# Altium schematic sheet 07_ux.SchDoc
size B
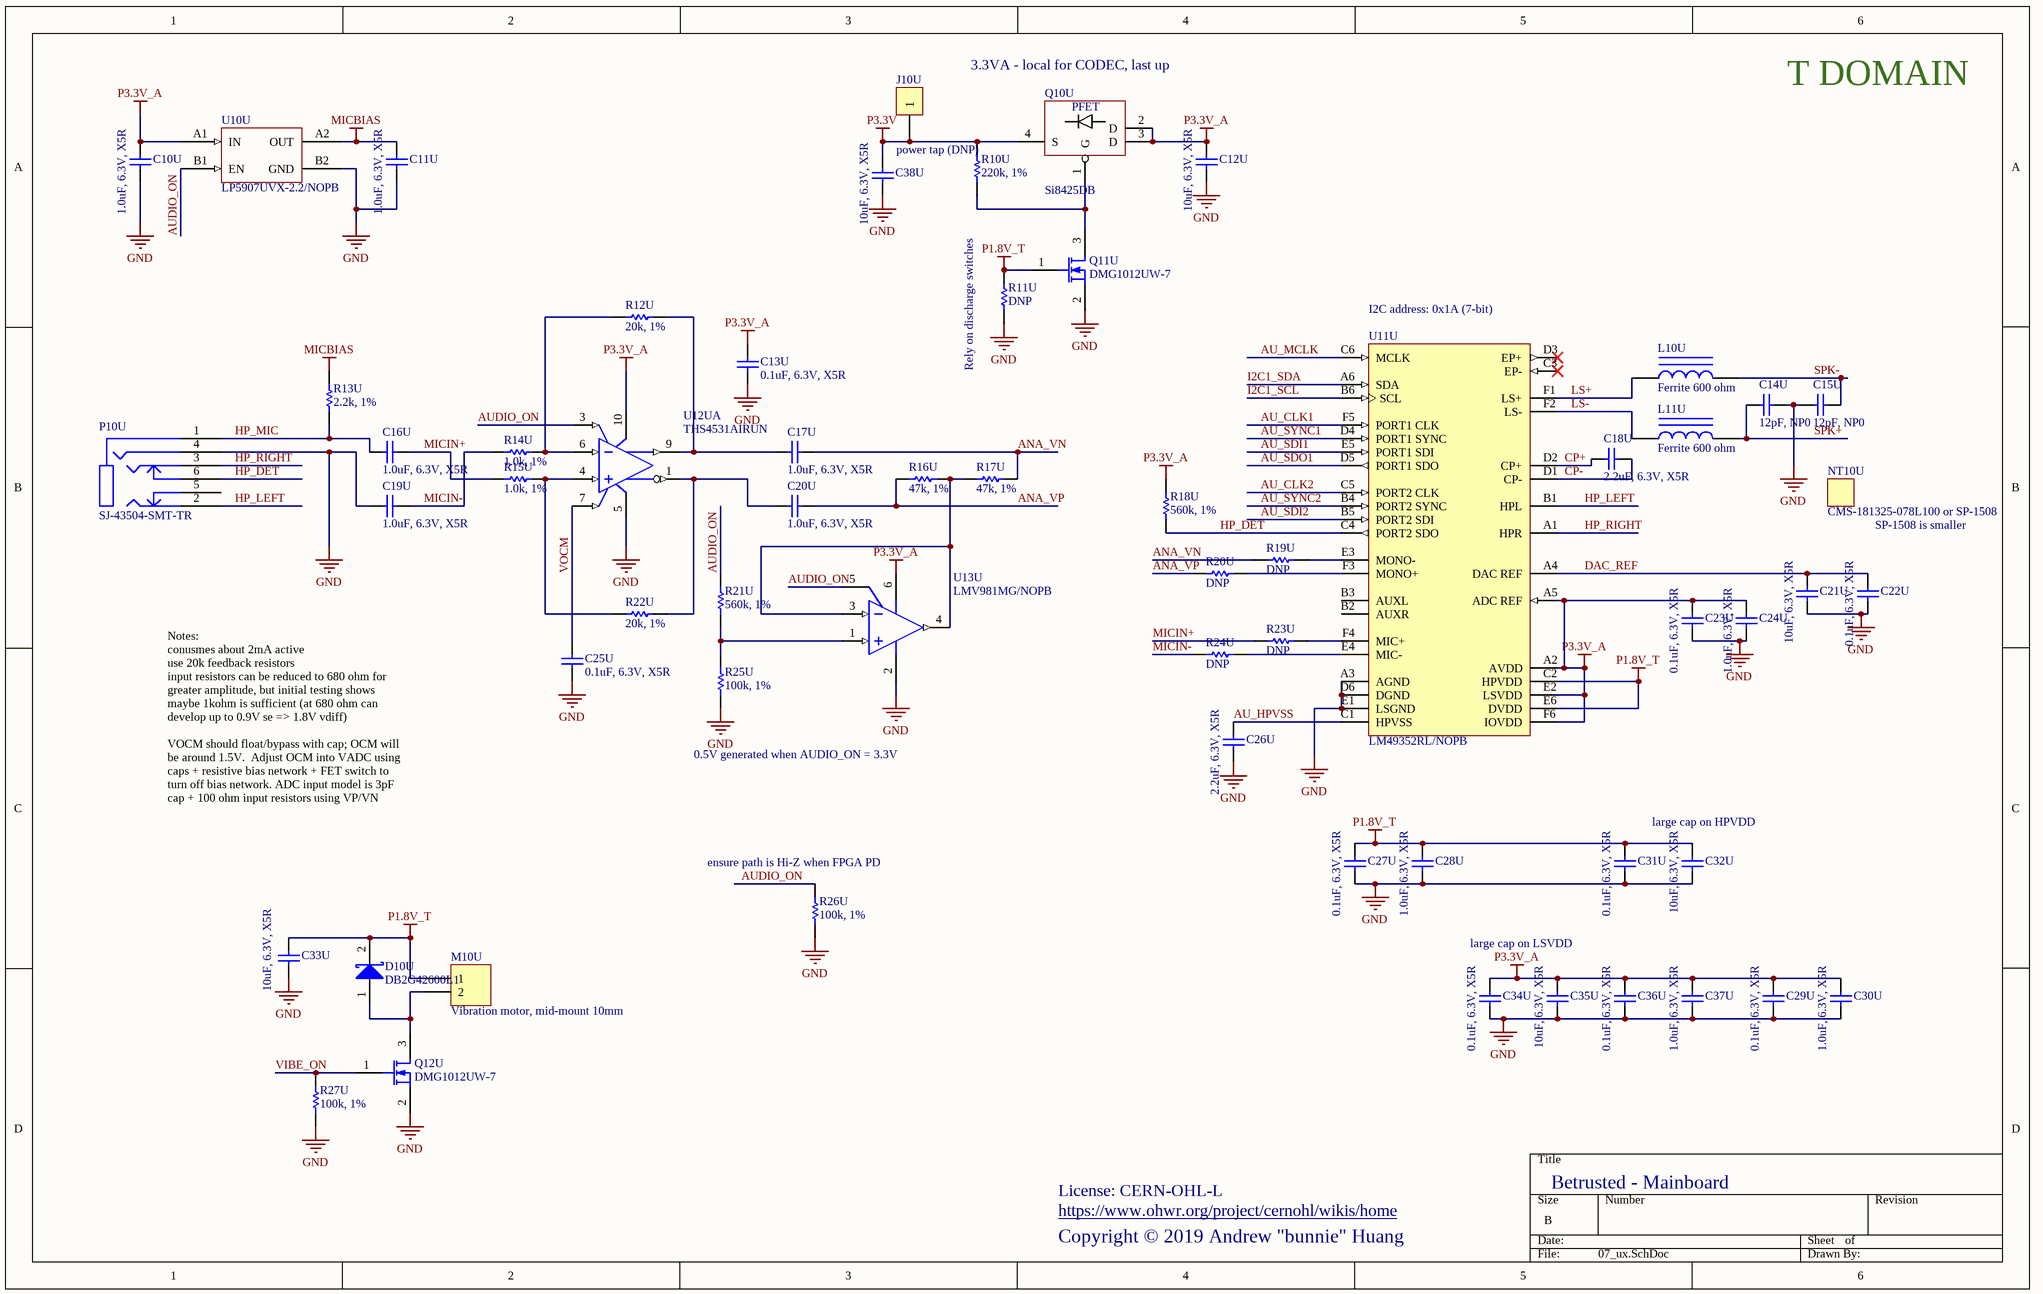
[diagram p0: 07_ux.SchDoc]

## Parts
C10U  1.0uF, 6.3V, X5R  [B_CAP0201]
C11U  1.0uF, 6.3V, X5R  [B_CAP0201]
C12U  10uF, 6.3V, X5R  [B_CAP0603]
C13U  0.1uF, 6.3V, X5R  [B_CAP0201]
C14U  12pF, NP0  [B_CAP0201]
C15U  12pF, NP0  [B_CAP0201]
C16U  1.0uF, 6.3V, X5R  [B_CAP0201]
C17U  1.0uF, 6.3V, X5R  [B_CAP0201]
C18U  2.2uF, 6.3V, X5R  [B_CAP0402]
C19U  1.0uF, 6.3V, X5R  [B_CAP0201]
C20U  1.0uF, 6.3V, X5R  [B_CAP0201]
C21U  10uF, 6.3V, X5R  [B_CAP0603]
C22U  0.1uF, 6.3V, X5R  [B_CAP0201]
C23U  0.1uF, 6.3V, X5R  [B_CAP0201]
C24U  1.0uF, 6.3V, X5R  [B_CAP0201]
C25U  0.1uF, 6.3V, X5R  [B_CAP0201]
C26U  2.2uF, 6.3V, X5R  [B_CAP0402]
C27U  0.1uF, 6.3V, X5R  [B_CAP0201]
C28U  1.0uF, 6.3V, X5R  [B_CAP0201]
C29U  0.1uF, 6.3V, X5R  [B_CAP0201]
C30U  1.0uF, 6.3V, X5R  [B_CAP0201]
C31U  0.1uF, 6.3V, X5R  [B_CAP0201]
C32U  10uF, 6.3V, X5R  [B_CAP0603]
C33U  10uF, 6.3V, X5R  [B_CAP0603]
C34U  0.1uF, 6.3V, X5R  [B_CAP0201]
C35U  10uF, 6.3V, X5R  [B_CAP0603]
C36U  0.1uF, 6.3V, X5R  [B_CAP0201]
C37U  1.0uF, 6.3V, X5R  [B_CAP0201]
C38U  10uF, 6.3V, X5R  [B_CAP0603]
D10U  DB2G42600L1  [B_DIO0402]
J10U  power tap (DNP)  [RESTAP-0603]
L10U  Ferrite 600 ohm  [B_IND0603]
L11U  Ferrite 600 ohm  [B_IND0603]
M10U  Vibration motor, mid-mount 10mm  [JINLONG-C1020K001F]
NT10U  CMS-181325-078L100 or SP-1508
P10U  SJ-43504-SMT-TR  [CUI_SJ_43504_SMT_TR_FLIP]
Q10U  Si8425DB  [VISHAY_MICRO_FOOT_4_BUMP]
Q11U  DMG1012UW-7  [SOT323-3AN]
Q12U  DMG1012UW-7  [SOT323-3AN]
R10U  220k, 1%  [B_RES0201]
R11U  DNP  [B_RES0201]
R12U  20k, 1%  [B_RES0201]
R13U  2.2k, 1%  [B_RES0201]
R14U  1.0k, 1%  [B_RES0201]
R15U  1.0k, 1%  [B_RES0201]
R16U  47k, 1%  [B_RES0201]
R17U  47k, 1%  [B_RES0201]
R18U  560k, 1%  [B_RES0201]
R19U  DNP  [B_RES0201]
R20U  DNP  [B_RES0201]
R21U  560k, 1%  [B_RES0201]
R22U  20k, 1%  [B_RES0201]
R23U  DNP  [B_RES0201]
R24U  DNP  [B_RES0201]
R25U  100k, 1%  [B_RES0201]
R26U  100k, 1%  [B_RES0201]
R27U  100k, 1%  [B_RES0201]
U10U  LP5907UVX-2.2/NOPB  [TI_YKE004]
U11U  LM49352RL/NOPB  [YPG0036AWAW]
U12U  THS4531AIRUN  [RUN0010A]  (part A of 2)
U13U  LMV981MG/NOPB  [DCK0006A_N]

## Nets
GND: C10U.2 C11U.2 C12U.2 C13U.1 C14U.2 C15U.1 C19U.1 C21U.2 C22U.2 C23U.2 C24U.1 C25U.1 C26U.1 C27U.2 C28U.1 C29U.2 C30U.1 C31U.2 C32U.2 C33U.1 C34U.2 C35U.2 C36U.2 C37U.1 C38U.2 P10U.4(RING2) Q11U.2(S) Q12U.2(S) R11U.1 R25U.1 R26U.1 R27U.1 U10U.B2(GND) U11U.A3(AGND) U11U.D6(DGND) U11U.E1(LSGND) U12U.5(VS-) U13U.2(GND)
MICBIAS: C11U.1 R13U.2 U10U.A2(OUT)
P1.8V_T: C27U.1 C28U.2 C31U.1 C32U.1 C33U.2 D10U.2(K) M10U.1 Q11U.1(G) R11U.2 U11U.C2(HPVDD) U11U.E6(DVDD)
P3.3V: C38U.1 J10U.1 Q10U.4(S) R10U.2
P3.3V_A: C10U.1 C12U.1 C13U.2 C23U.1 C24U.2 C29U.1 C30U.2 C34U.1 C35U.1 C36U.1 C37U.2 Q10U.2(D) Q10U.3(D) R18U.2 U10U.A1(IN) U11U.A2(AVDD) U11U.A5(ADC_REF) U11U.E2(LSVDD) U11U.F6(IOVDD) U12U.10(VS+) U13U.6(VDD)
ANA_VN: C17U.2 R17U.1 R19U.2
ANA_VP: C20U.2 R16U.2 R20U.2
AU_CLK1: U11U.F5(PORT1_CLK)
AU_CLK2: U11U.C5(PORT2_CLK)
AU_HPVSS: C26U.2 U11U.C1(HPVSS)
AU_MCLK: U11U.C6(MCLK)
AU_SDI1: U11U.E5(PORT1_SDI)
AU_SDI2: U11U.B5(PORT2_SDI)
AU_SDO1: U11U.D5(PORT1_SDO)
AU_SYNC1: U11U.D4(PORT1_SYNC)
AU_SYNC2: U11U.B4(PORT2_SYNC)
AUDIO_ON: R21U.2 R26U.2 U10U.B1(EN) U12U.3(~{PD}) U13U.5(~{SHDN})
CP+: C18U.2 U11U.D2(CP+)
CP-: C18U.1 U11U.D1(CP-)
DAC_REF: C21U.1 C22U.1 U11U.A4(DAC_REF)
HP_DET: P10U.6(RING1_SW) R18U.1 U11U.C4(PORT2_SDO)
HP_LEFT: P10U.2(TIP) U11U.B1(HPL)
HP_MIC: C16U.1 P10U.1(SLEEVE) R13U.1
HP_RIGHT: P10U.3(RING1) U11U.A1(HPR)
I2C1_SCL: U11U.B6(SCL)
I2C1_SDA: U11U.A6(SDA)
LS+: L10U.1 U11U.F1(LS+)
LS-: L11U.1 U11U.F2(LS-)
MICIN+: C16U.2 R15U.2 R23U.2
MICIN-: C19U.2 R14U.2 R24U.2
SPK+: C14U.1 L11U.2
SPK-: C15U.2 L10U.2
VIBE_ON: Q12U.1(G) R27U.2
VOCM: C25U.2 U12U.7(VOCM)
NetC17U_1: C17U.1 R12U.1 U12U.9(VOUT+)
NetC20U_1: C20U.1 R22U.1 U12U.1(VOUT-)
NetD10U_1: D10U.1(A) M10U.2 Q12U.3(D)
NetQ10U_1: Q10U.1(G) Q11U.3(D) R10U.1
NetR12U_2: R12U.2 R14U.1 U12U.6(VIN-)
NetR15U_1: R15U.1 R22U.2 U12U.4(VIN+)
NetR16U_1: R16U.1 R17U.2 U13U.3(IN-) U13U.4(OUT)
NetR19U_1: R19U.1 U11U.E3(MONO-)
NetR20U_1: R20U.1 U11U.F3(MONO+)
NetR21U_1: R21U.1 R25U.2 U13U.1(IN+)
NetR23U_1: R23U.1 U11U.F4(MIC+)
NetR24U_1: R24U.1 U11U.E4(MIC-)

Not connected (* = marked no-connect by the designer): P10U 5(TIP_SW); U11U B2(AUXR) B3(AUXL) C3(EP-)* D3(EP+)*

## Notes on the sheet
- 3.3VA - local for CODEC, last up
- T DOMAIN
- Rely on discharge switches
- (near U11U) I2C address: 0x1A (7-bit)
- SP-1508 is smaller
- 0.5V generated when AUDIO_ON = 3.3V
- Notes:
  conusmes about 2mA active
  use 20k feedback resistors
  input resistors can be reduced to 680 ohm for greater amplitude, but initial testing shows maybe 1kohm is sufficient (at 680 ohm can develop up to 0.9V se => 1.8V vdiff)
  VOCM should float/bypass with cap; OCM will be around 1.5V.  Adjust OCM into VADC using caps + resistive bias network + FET switch to turn off bias network. ADC input model is 3pF cap + 100 ohm input resistors using VP/VN
- large cap on HPVDD
- (near R26U) ensure path is Hi-Z when FPGA PD
- large cap on LSVDD
- License: CERN-OHL-L
- Copyright © 2019 Andrew "bunnie" Huang
- https://www.ohwr.org/project/cernohl/wikis/home
- Betrusted - Mainboard
- (in symbol Si8425DB) PFET

## Library data of the parts
C10U C11U C16U C17U C19U C20U = Cap Semi: Capacitor (Semiconductor SIM Model); MPN: GRM033R60J105MEA2D; VENDOR: Murata; MYPN: C-105-6p3-X5R-0603
C12U C21U C32U C33U C35U C38U = Cap Semi: Capacitor (Semiconductor SIM Model); MPN: CL10A106MQ8NNNC; VENDOR: Samsung; MYPN: C-106-6.3-X5R-0603
C13U C22U C23U C25U C27U C29U C31U C34U C36U = Cap Semi: Capacitor (Semiconductor SIM Model); MPN: CL03A104KQ3NNNC; VENDOR: Samsung; MYPN: C-104-6p3-X5R-0201
C14U C15U = Cap Semi: Capacitor (Semiconductor SIM Model); MPN: GRM0335C1E120JA01D; VENDOR: Murata; MYPN: C-120-25-NP0-0201
C18U C26U = Cap Semi: Capacitor (Semiconductor SIM Model); MPN: CL05A225MQ5NNNC; VENDOR: Samsung; MYPN: C-225-6p3-X5R-0402
C24U C28U C30U C37U = Cap Semi: Capacitor (Semiconductor SIM Model); MPN: GRM033R60J105MEA2D; VENDOR: Murata; MYPN: C-105-6p3-X5R-0201
D10U = Diode 11DQ03: Schottky Rectifier; MYPN: D-SCHOTTKY-0402-CSP; VENDOR: Panasonic; ComponentLink1Description: Manufacturer Link; ComponentLink1URL: http://www.irf.com/; ComponentLink2Description: Datasheet; ComponentLink2URL: http://www.irf.com/product-info/datasheets/data/11dq03.pdf; MPN: DB2G42600L1
J10U = CON1: Connector; MYPN: J-TP-PWRTAP-0603; MPN: DNP; VENDOR: DNP
L10U L11U = Inductor Iron: Magnetic-Core Inductor; MPN: BLM18AG601SN1D; VENDOR: Murata; MYPN: L-BLM18AG601SN1D
M10U = Header 2: MPN: C1020K001F; VENDOR: Jinlong; MYPN: M-VIBE-10MM-MID; LatestRevisionDate: 17-Jul-2002; LatestRevisionNote: Re-released for DXP Platform.; Publisher: Altium Limited
NT10U = NOTE: Placeholder for non-board BOM items; MYPN: NT-CUI-SPEAKER; VENDOR: CUI or Soberton; MPN: CMS-181325-078L100 or SP-1508
P10U = CUI_3.5MM_STEREO_MIC: Mid mount audio jack; VENDOR: CUI; MYPN: J-3.5MM-MID-CUI; MPN: SJ-43504-SMT-TR
Q10U = Si8425DB: P-channel 20V 6.2A 27mOhm @ -2.5V; MPN: SI8457DB-T1-E1; VENDOR: Vishay Siliconix; MYPN: Q-Si8457
Q11U Q12U = MOSFET-N: N-Channel MOSFET; VENDOR: Diodes Inc; MYPN: Q-DMG1012UW-7; Published: 8-Jun-2000; LatestRevisionDate: 17-Jul-2002; LatestRevisionNote: Re-released for DXP Platform.; PackageVersion: 1995/1996; PackageReference: E3; Publisher: Altium Limited; MPN: DMG1012UW-7
R10U = Res1: Resistor; VENDOR: ANY; MYPN: R-224-1P-1_16W-0201; MPN: ANY
R11U R19U R20U R23U R24U = Res1: Resistor; VENDOR: ANY; MYPN: DNP; MPN: ANY
R12U R22U = Res1: Resistor; VENDOR: ANY; MYPN: R-203-1P-1_16W-0201; MPN: ANY
R13U = Res1: Resistor; VENDOR: ANY; MYPN: R-222-1P-1_16W-0201; MPN: ANY
R14U R15U = Res1: Resistor; VENDOR: ANY; MYPN: R-102-1P-1_16W-0201; MPN: ANY
R16U R17U = Res1: Resistor; VENDOR: ANY; MYPN: R-473-1P-1_16W-0201; MPN: ANY
R18U R21U = Res1: Resistor; VENDOR: ANY; MYPN: R-564-1P-1_16W-0201; MPN: ANY
R25U R26U R27U = Res1: Resistor; VENDOR: ANY; MYPN: R-104-1P-1_16W-0201; MPN: ANY
U10U = LP5907UVX: Ultra low-noise 250mA LDO for RF and analog in DSBGA; VENDOR: TI; MYPN: ULP5907UVX-2.2; MPN: LP5907UVX-2.2/NOPB
U11U = AMP-AUDA-LM49352-36: MYPN: U-LM49352RL/NOPB; VENDOR: TI; MPN: LM49352RL/NOPB
U12U = TI-THS4531X-RUN10: Ultra Low-Power, RRIO, Fully Differential Amplifier; MPN: THS4531AIRUNT; VENDOR: TI; MYPN: U-THS4531AIRUN(T/R)
U13U = CMP-0055-01099-3: Single 1.8V, RRIO Operational Amplifiers with Shutdown, 6-pin SC-70, Pb-Free; PowerWise: N; PackageTopMarking: A77*XTT; VENDOR: Texas Instruments; ComponentLink1URL: http://www.ti.com/general/docs/lit/getliterature.tsp?genericPartNumber=LMV981-N&fileType=pdf; PackageDescription: Molded SC-70, 2 x 1.25 x .9mm, 6 Lead, 0.65mm Pitch; RoHS: Y; PinCount: 6; ComponentLink1Description: Datasheet URL; CompType: Amplifiers; Package Reference: DCK0006A; MPN: LMV981MG/NOPB